# Altium schematic sheet 1_Sheet_1.schdoc
size 302 x 215 mm; Name: A_A4; Symbol: A_A4; Device: A_A4; @Project Name: SAE_4_2026; REV: 1.0; Date: 2025-01-23; Sheet: 1/1; Draw By: quentin.perbost; Company: Your Company; Convert to PCB: yes; Add into BOM: yes; spicePre: .; @Page No: 1; @Page Count: 1; @Schematic Name: SAE_4; @Board Name: SAE_4; @Update Date: 2026-02-12; @Create Time: 08:27:33; @Update Time: 09:27:35; @Page Name: Sheet_1; @Create Date: 2026-02-12
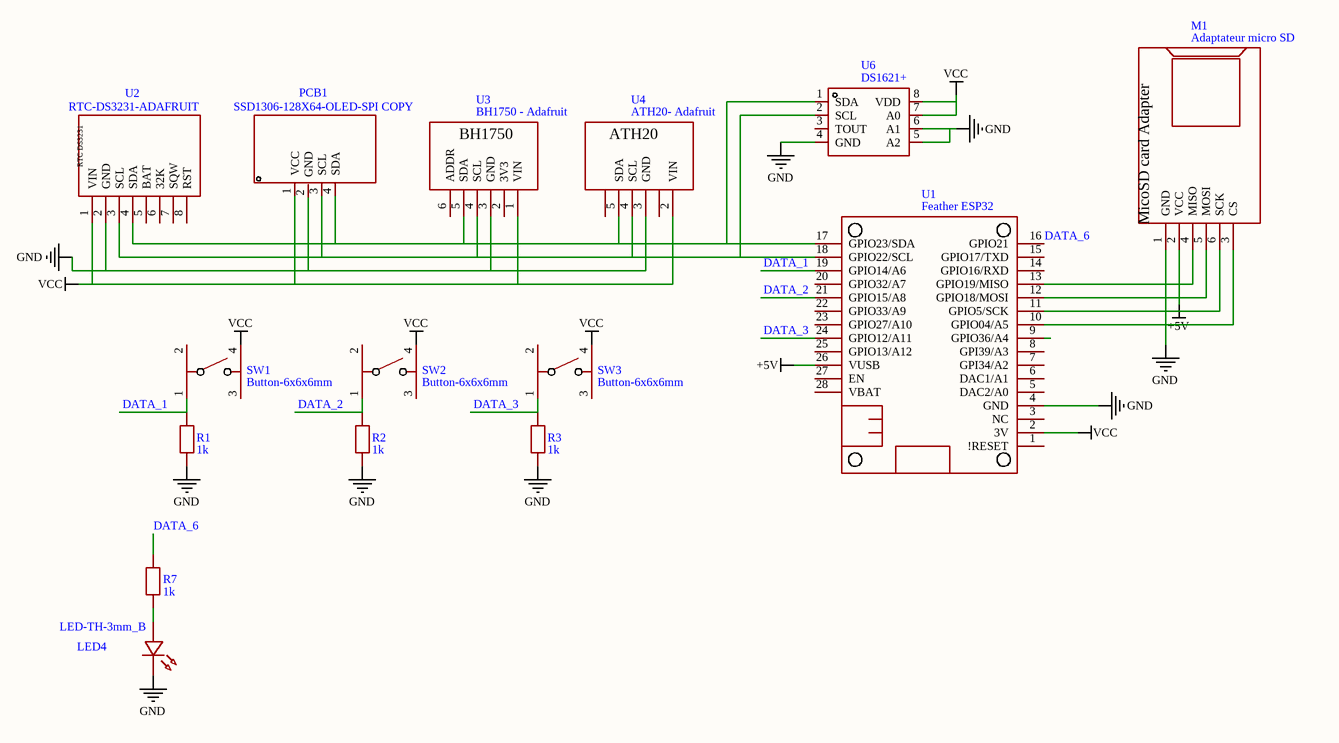
[diagram p0: 1_Sheet_1.schdoc]

## Parts
LED4  LED-TH-3mm_B  [LED-TH_BD3.0_BLUE]
M1  Adaptateur micro SD  [MICROSD_ADAPTER_BOARD]
PCB1  SSD1306-128X64-OLED-SPI COPY  [SSD1306]
R1  1k  [R_AXIAL-0.4]
R2  1k  [R_AXIAL-0.4]
R3  1k  [R_AXIAL-0.4]
R7  1k  [R_AXIAL-0.4]
SW1  Button-6x6x6mm  [SW-TH_4P-L6.0-W6.0-P4.50-LS6.1]
SW2  Button-6x6x6mm  [SW-TH_4P-L6.0-W6.0-P4.50-LS6.1]
SW3  Button-6x6x6mm  [SW-TH_4P-L6.0-W6.0-P4.50-LS6.1]
U1  Feather ESP32  [ADAFRUIT FEATHER ESP32]
U2  RTC-DS3231-ADAFRUIT  [RTC-DS3231-ADAFRUIT]
U3  BH1750 - Adafruit  [BH1750 - ADAFRUIT]
U4  ATH20- Adafruit  [BH1750 - ADAFRUIT]
U6  DS1621+  [DIP-8_L9.8-W6.6-P2.54-LS7.6-BL]

## Nets
+5V: M1.2(VCC) U1.26(VUSB)
GND: LED4.2 M1.1(GND) PCB1.2(GND) R1.2 R2.2 R3.2 U1.4(GND) U2.2(GND) U3.3(GND) U4.3(3V3) U6.4(GND) U6.5(A2) U6.6(A1)
VCC: PCB1.1(VCC) SW1.4 SW2.4 SW3.4 U1.2(3V) U2.1(VIN) U3.1(VIN) U4.2(VIN) U6.7(A0) U6.8(VDD)
DATA_1: R1.1 SW1.1 U1.19(GPIO14/A6)
DATA_2: R2.1 SW2.1 U1.21(GPIO15/A8)
DATA_3: R3.1 SW3.1 U1.24(GPIO12/A11)
DATA_6: R7.2 U1.16(GPIO21)
NetLED4_1: LED4.1 R7.1
NetM1_3: M1.3(CS) U1.10(GPIO04/A5)
NetM1_4: M1.4(MISO) U1.13(GPIO19/MISO)
NetM1_5: M1.5(MOSI) U1.12(GPIO18/MOSI)
NetM1_6: M1.6(SCK) U1.11(GPIO5/SCK)
NetPCB1_3: PCB1.3(SCL) U1.18(GPIO22/SCL) U2.3(SCL) U3.4(SCL) U4.4(SCL) U6.2(SCL)
NetPCB1_4: PCB1.4(SDA) U1.17(GPIO23/SDA) U2.4(SDA) U3.5(SDA) U4.5(SDA) U6.1(SDA)

Not connected (* = marked no-connect by the designer): SW1 2 3; SW2 2 3; SW3 2 3; U1 1(!RESET) 3(NC) 5(DAC2/A0) 6(DAC1/A1) 7(GPI34/A2) 8(GPI39/A3) 9(GPIO36/A4) 14(GPIO16/RXD) 15(GPIO17/TXD) 20(GPIO32/A7) 22(GPIO33/A9) 23(GPIO27/A10) 25(GPIO13/A12) 27(EN) 28(VBAT); U2 5(BAT) 6(32K) 7(SQW) 8(RST); U3 2(3V3) 6(ADDR); U4 6(ADDR); U6 3(TOUT)

## Notes on the sheet
- 1
- 2
- 3
- 4
- 5
- A
- B
- C
- D
- TITLE:
- SAE_4_2026
- REV:
- 1.0
- Date:
- Company:
- 2025-01-23
- Your Company
- Drawn By:
- quentin.perbost
- Sheet:
- 1/1
- (in symbol Adaptateur micro SD) MicoSD card Adapter
- (in symbol ATH20- Adafruit) ATH20
- (in symbol BH1750 - Adafruit) BH1750
- (in symbol RTC-DS3231-ADAFRUIT) RTC DS3231

## Library data of the parts
LED4 = LED-TH-3mm_B: Manufacturer: EVERLIGHT(台湾亿光); Manufacturer Part: 204-10SUBC/S400-A4; Convert to PCB: yes; Contributor: LCEDA_Lib; Symbol: LED-TH-3mm_B; Device: LED-TH-3mm_B; Supplier Part: C86881; Supplier: LCSC; Add into BOM: yes; Origin Footprint: LED-TH_BD3.0_BLUE; spicePre: L; spiceSymbolName: LED-TH-3mm_B
M1 = Adaptateur micro SD: Convert to PCB: yes; Contributor: LTG Tech; Symbol: Adaptateur micro SD; Device: Adaptateur micro SD; Add into BOM: yes; Origin Footprint: MICROSD_ADAPTER_BOARD; spicePre: M; spiceSymbolName: Adaptateur micro SD
PCB1 = SSD1306-128X64-OLED-SPI COPY: Convert to PCB: yes; sourceId: wICUcuL3l; Symbol: SSD1306-128X64-OLED-SPI COPY; Device: SSD1306-128X64-OLED-SPI COPY; Add into BOM: yes; Origin Footprint: SSD1306; spicePre: X; timeStamp: 1456014235; spiceSymbolName: SSD1306-128X64-OLED-SPI COPY
R1-R3 R7 = 1k: Convert to PCB: yes; nameAlias: Value(Ω); Contributor: LCEDA_Lib; Symbol: 1k; Device: 1k; Add into BOM: yes; Origin Footprint: R_AXIAL-0.4; spicePre: R; spiceSymbolName: R_AXIAL-0.4_EU
SW1-SW3 = Button-6x6x6mm: Manufacturer: BBJ; Manufacturer Part: Switch,6*6*6Plastic head,260G, 0.25mm,Straight line; Convert to PCB: yes; Symbol: Button-6x6x6mm; Device: Button-6x6x6mm; Supplier Part: C71836; Supplier: LCSC; Add into BOM: yes; Origin Footprint: SW-TH_4P-L6.0-W6.0-P4.50-LS6.1; spicePre: S; spiceSymbolName: Button-6x6x6mm
U1 = Feather ESP32: Convert to PCB: yes; sourceId: 0S0UN5Zhz; Contributor: kristylynn9598; Symbol: Feather ESP32; Device: Feather ESP32; Add into BOM: yes; Origin Footprint: ADAFRUIT FEATHER ESP32; timeStamp: 1457326346; spicePre: U; spiceSymbolName: Feather ESP32
U2 = RTC-DS3231-ADAFRUIT: Convert to PCB: yes; Contributor: JEEn; Symbol: RTC-DS3231-ADAFRUIT; Device: RTC-DS3231-ADAFRUIT; Manufacturer: ADAFRUIT; Add into BOM: yes; Origin Footprint: RTC-DS3231-ADAFRUIT; spicePre: U; spiceSymbolName: RTC-DS3231-ADAFRUIT
U3 = BH1750 - Adafruit: Convert to PCB: yes; Contributor: mengrie; Symbol: BH1750 - Adafruit; Device: BH1750 - Adafruit; Supplier: Adafruit; Add into BOM: yes; Origin Footprint: BH1750 - ADAFRUIT; spicePre: U; spiceSymbolName: BH1750 - Adafruit
U4 = ATH20- Adafruit: Convert to PCB: yes; Contributor: mengrie; Package Display: No; Symbol: ATH20- Adafruit; Device: ATH20- Adafruit; Add into BOM: yes; Origin Footprint: BH1750 - ADAFRUIT; spicePre: U; spiceSymbolName: BH1750 - Adafruit
U6 = DS1621+: Manufacturer: ADI(亚德诺)/MAXIM(美信); Convert to PCB: yes; Contributor: LCSC; Symbol: DS1621+; Device: DS1621+; Supplier Part: C722439; Supplier: LCSC; Manufacturer Part: DS1621+; JLCPCB Part Class: Extended Part; Add into BOM: yes; Origin Footprint: DIP-8_L9.8-W6.6-P2.54-LS7.6-BL; spicePre: U; spiceSymbolName: DS1621+